# EAGLE design MUDE V2 (EAGLE 7.3.0)

## Sheet 1 of 2
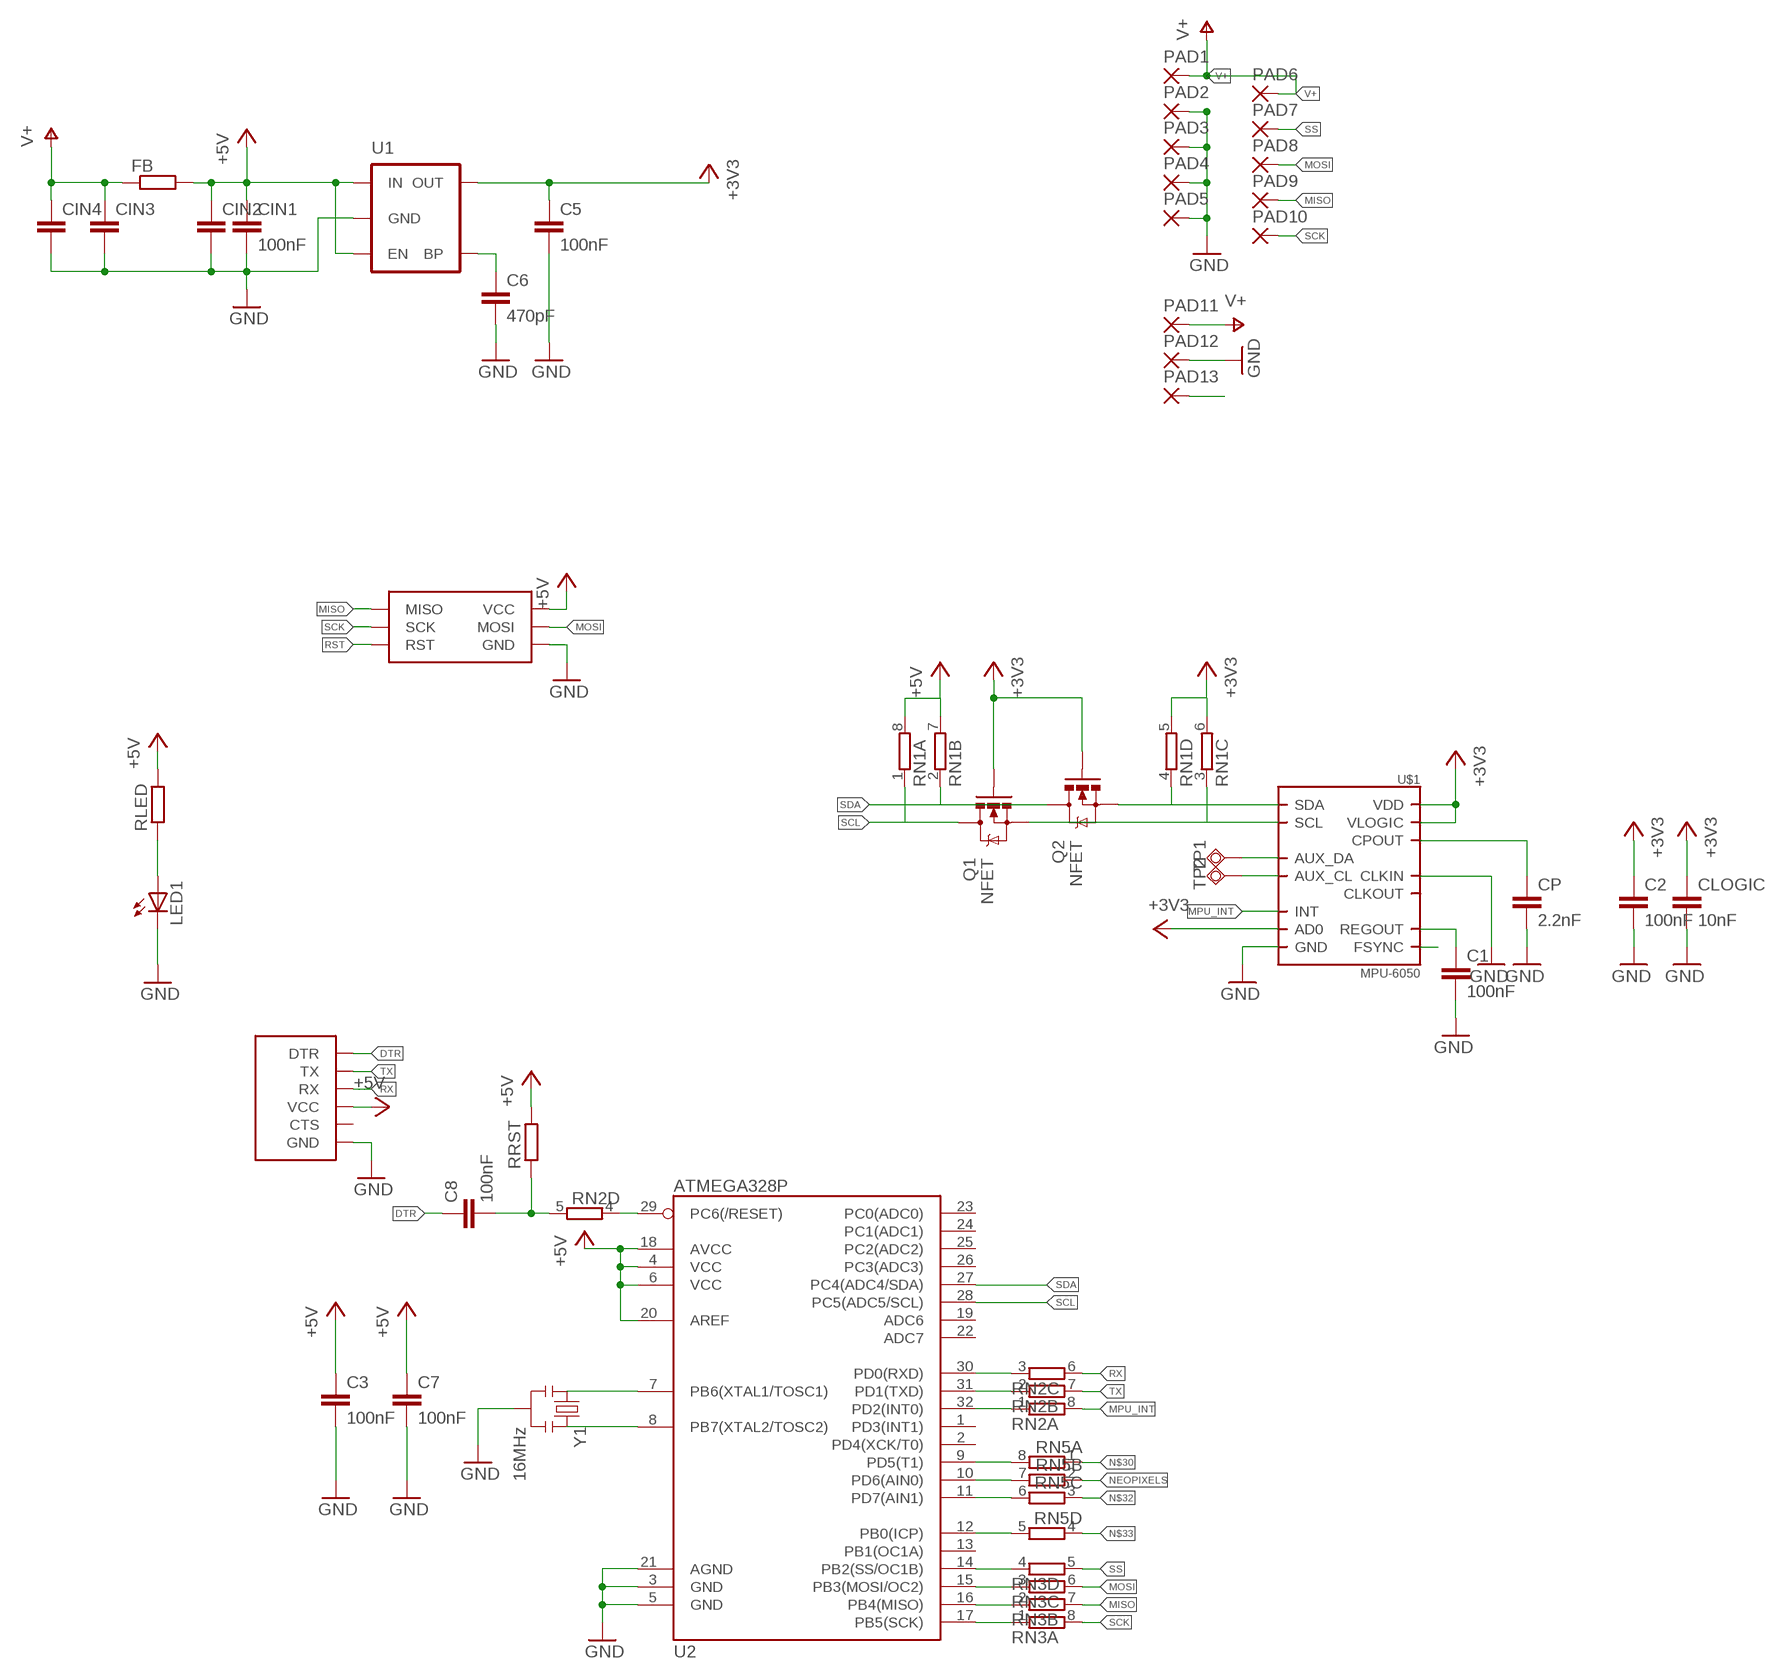
[diagram p0: schematic, sheet 1]

### Parts
C1  100nF  C-EUC0603  [C0603]
C2  100nF  C-EUC0603  [C0603]
C3  100nF  C-EUC0603  [C0603]
C5  100nF  C-EUC0805  [C0805]
C6  470pF  C-EUC0603  [C0603]
C7  100nF  C-EUC0603  [C0603]
C8  100nF  C-EUC0603  [C0603]
CIN1  100nF  C-EUC0603  [C0603]
CIN2  C-EUC0805  [C0805]
CIN3  C-EUC1210  [C1210]
CIN4  C-EUC1210  [C1210]
CLOGIC  10nF  C-EUC0603  [C0603]
CP  2.2nF  C-EUC0603  [C0603]
FB  R-EU_R0603  [R0603]
LED1  LED0603  [LED-0603]
PAD1  SMD2  [SMD1,27-2,54]
PAD2  SMD2  [SMD1,27-2,54]
PAD3  SMD2  [SMD1,27-2,54]
PAD4  SMD2  [SMD1,27-2,54]
PAD5  SMD2  [SMD1,27-2,54]
PAD6  SMD2  [SMD1,27-2,54]
PAD7  SMD2  [SMD1,27-2,54]
PAD8  SMD2  [SMD1,27-2,54]
PAD9  SMD2  [SMD1,27-2,54]
PAD10  SMD2  [SMD1,27-2,54]
PAD11  SMD2  [SMD1,27-2,54]
PAD12  SMD2  [SMD1,27-2,54]
PAD13  SMD2  [SMD1,27-2,54]
Q1  NFET  MOSFET-NCHANNELBSS123LT1G  [SOT23]
Q2  NFET  MOSFET-NCHANNELBSS123LT1G  [SOT23]
RLED  R-EU_R0603  [R0603]
RN1  4R-N0603-ARV  [0603-ARV]
RN2  4R-N0603-ARV  [0603-ARV]
RN3  4R-N0603-ARV  [0603-ARV]
RN5  4R-N0603-ARV  [0603-ARV]
RRST  R-EU_R0603  [R0603]
TP1  TPSQTP10R  [TP10R]
TP2  TPSQTP10R  [TP10R]
U1  MIC52053.3V  [SOT23-5]
U2  ATMEGA328P  ATMEGA328_SMT  [TQFP32-08]
U$1  MPU-6050  [QFN.24.4X4]
U$2  FTDI_HEADERSMD  [FTDI_HEADER_SMD]
U$3  ISP_POGOISP_POGO  [ISP_POGO]
Y1  16MHz  RESONATOR16MHZ  [RESONATOR-SMD]

### Nets
+3V3: C2.1 C5.1 CLOGIC.1 Q1.1(G) Q2.1(G) RN1.5 RN1.6 U1.5(OUT) U$1.8(VLOGIC) U$1.9(AD0) U$1.13(VDD)
+5V: C3.1 C7.1 CIN1.1 CIN2.1 FB.2 RLED.2 RN1.7 RN1.8 RRST.2 U1.1(IN) U1.3(EN) U2.4(VCC) U2.6(VCC) U2.18(AVCC) U2.20(AREF) U$2.VCC U$3.VCC
DTR: C8.1 U$2.DTR
GND: C1.2 C2.2 C3.2 C5.2 C6.2 C7.2 CIN1.2 CIN2.2 CIN3.2 CIN4.2 CLOGIC.2 CP.2 LED1.C PAD2.1(P) PAD3.1(P) PAD4.1(P) PAD5.1(P) PAD12.1(P) U1.2(GND) U2.3(GND) U2.5(GND) U2.21(AGND) U$1.1(CLKIN) U$1.18(GND) U$2.GND U$3.GND Y1.2
MISO: PAD9.1(P) RN3.7 U$3.MISO
MOSI: PAD8.1(P) RN3.6 U$3.MOSI
MPU_INT: RN2.8 U$1.12(INT)
N$1: CP.1 U$1.20(CPOUT)
N$2: RN2.3 U2.30(PD0(RXD))
N$4: TP1.TP U$1.6(AUX_DA)
N$5: C6.1 U1.4(BP)
N$6: TP2.TP U$1.7(AUX_CL)
N$7: Q2.2(S) RN1.4 U$1.24(SDA)
N$8: RN5.8 U2.9(PD5(T1))
N$9: Q1.2(S) RN1.3 U$1.23(SCL)
N$10: U2.7(PB6(XTAL1/TOSC1)) Y1.1
N$11: LED1.A RLED.1
N$12: C1.1 U$1.10(REGOUT)
N$13: U$1.11(FSYNC)
N$14: RN2.2 U2.31(PD1(TXD))
N$15: U2.8(PB7(XTAL2/TOSC2)) Y1.3
N$16: RN5.7 U2.10(PD6(AIN0))
N$18: RN2.1 U2.32(PD2(INT0))
N$19: RN2.4 U2.29(PC6(/RESET))
N$20: RN5.6 U2.11(PD7(AIN1))
N$22: RN3.1 U2.17(PB5(SCK))
N$23: RN3.2 U2.16(PB4(MISO))
N$24: RN3.3 U2.15(PB3(MOSI/OC2))
N$25: RN3.4 U2.14(PB2(SS/OC1B))
N$26: RN5.5 U2.12(PB0(ICP))
N$29: C8.2 RN2.5 RRST.1
N$30: RN5.1
N$32: RN5.3
N$33: RN5.4
NEOPIXELS: PAD13.1(P) RN5.2
RST: U$3.RST
RX: RN2.6 U$2.RX
SCK: PAD10.1(P) RN3.8 U$3.SCK
SCL: Q1.3(D) RN1.1 U2.28(PC5(ADC5/SCL))
SDA: Q2.3(D) RN1.2 U2.27(PC4(ADC4/SDA))
SS: PAD7.1(P) RN3.5
TX: RN2.7 U$2.TX
V+: CIN3.1 CIN4.1 FB.1 PAD1.1(P) PAD6.1(P) PAD11.1(P)
Unconnected: U2.1(PD3(INT1)) U2.2(PD4(XCK/T0)) U2.13(PB1(OC1A)) U2.19(ADC6) U2.22(ADC7) U2.23(PC0(ADC0)) U2.24(PC1(ADC1)) U2.25(PC2(ADC2)) U2.26(PC3(ADC3)) U$1.22(CLKOUT) U$2.CTS

## Sheet 2 of 2

## Library data of the parts
C1-C3 C5-C8 CIN1-CIN4 CLOGIC CP = wes:C-EU: CAPACITOR, European symbol
FB RLED RRST = wes:R-EU_: RESISTOR, European symbol
LED1 = SparkFun-LED:LED: LEDs Standard schematic elements and footprints for 5mm, 3mm, 1206, and 0603 sized LEDs. 5mm - Spark Fun Electronics SKU : COM-00529 (and others)
PAD1-PAD13 = wirepad:SMD2: SMD PAD
Q1 Q2 = SparkFun-DiscreteSemi:MOSFET-NCHANNEL: Common NMOSFET Parts MFG P/N Store ID Prod ID FDD8780 TRANS-09984 SI7820DN TRANS-11055 FDS6630A IC-08089 2N7002PW TRANS-11151 FQP30N06L COM-10213 TRANS-10060 BSS123LT1G TRANS-08345 BSS138 TRANS-00830 BS170 2N7000; PROD_ID: TRANS-08345
RN1-RN3 RN5 = resistor-dil:4R-N: Array Chip Resistor Source: RS Component / Phycomp; OC_FARNELL: unknown; OC_NEWARK: unknown
TP1 TP2 = testpad:TPSQ: Test pad
U1 = SparkFun-PowerIC:MIC5205: MIC5205 150mA vreg 3.3V - VREG-00822 5V - VREG-00823; PROD_ID: VREG-00822
U2 = SparkFun-DigitalIC:ATMEGA328_SMT: 32-Pin Atmega328 part Commonly used on Arduino compatible boards Available in QFP and QFN packages TQFP is IC-09069 QFN is non-stock; PROD_ID: IC-09069
U$1 = invensense:MPU-6050
U$2 = wes:FTDI_HEADER
U$3 = wes:ISP_POGO
Y1 = SparkFun-FreqCtrl:RESONATOR: Resonator Small SMD resonator. Used, eg, on the Arduino Pro/ Pro Mini boards. 8MHz- XTAL-08895 16MHz- XTAL-08900; PROD_ID: XTAL-08900

## Board
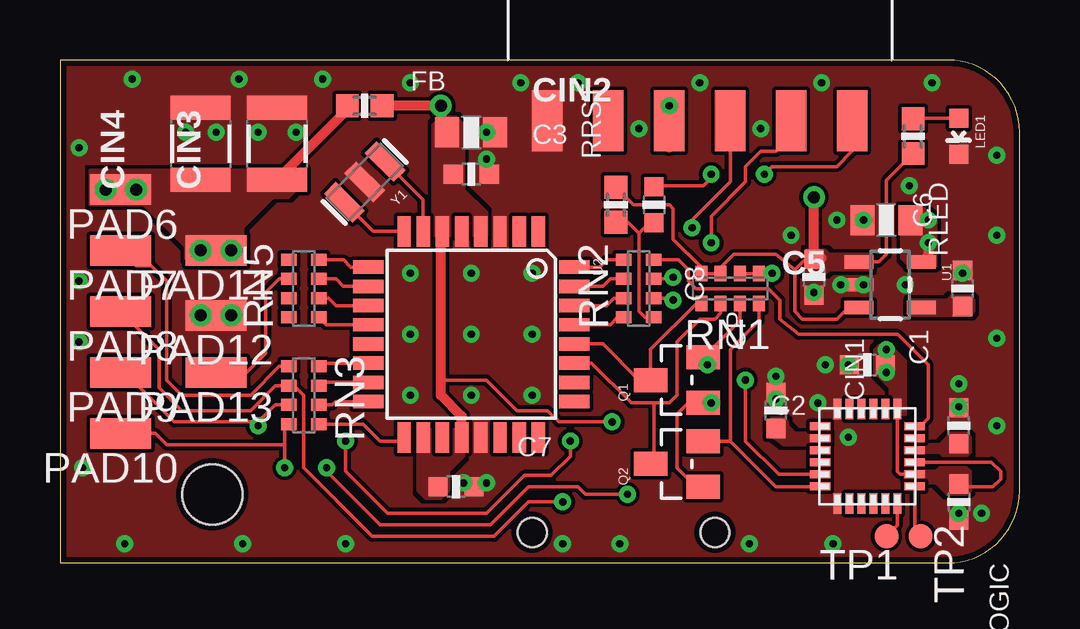
[diagram p1: board, top side]
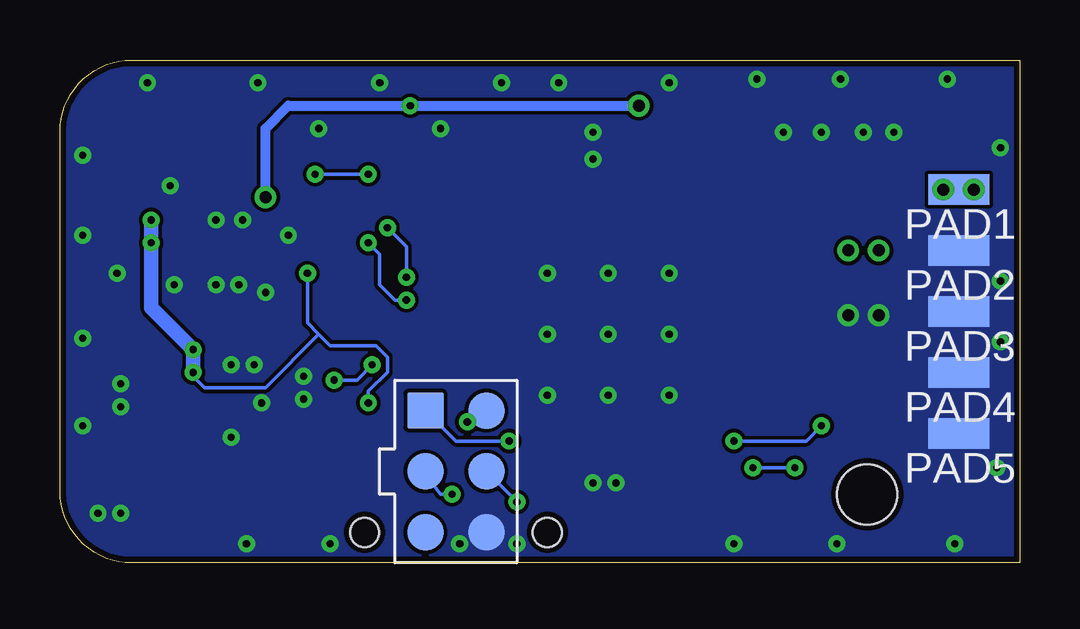
[diagram p2: board, bottom side, seen from below]

Size 40 x 20.95 mm. Coordinates in mm from the lower left corner, seen from the top.
Outline: 0,0 37,0 arc90 40,3 40,17.95 arc90 37,20.95 0,20.95 0,0
Copper layers (1*16): Top 0.035mm / dielectric 1.5mm / Bottom 0.035mm
Design rules "default *": minimum track width 6mil, minimum drill 0.3mm, track to track 6mil, track to pad 6mil, pad to pad 6mil, via to via 6mil, smd to smd 6mil, copper to edge 10mil, drill to drill 8mil, minimum pad ring 10mil, minimum via ring 8mil, stop-mask expansion 4mil, vias tented up to drill 0.3mm, thermal gap 10mil
Holes 2.5 mm at 6.35,2.86

### Footprints (pad centres in the part's own frame; a part is rotated, then mirrored left to right if it is on the bottom)
C0603 = smd 0.8 x 0.8: 1 -0.75,0; 2 0.75,0
C0805 = smd 1 x 1.25: 1 -1,0; 2 1,0
C1210 = smd 1 x 2.5: 1 -1.5,0; 2 1.5,0
R0603 = smd 0.95 x 0.95: 1 -0.725,0; 2 0.725,0
LED-0603 = smd 0.8 x 0.8: A 0,-0.75; C 0,0.75
SMD1,27-2,54 = smd 1.27 x 2.54: 1 0,0
SOT23 = smd 1 x 1.4: 1 -0.95,-1.1; 2 0.95,-1.1; 3 0,1.1
0603-ARV = smd 0.5 x 0.65: 1 -1.2,-0.625; 2 -0.4,-0.625; 3 0.4,-0.625; 4 1.2,-0.625; 5 1.2,0.625; 6 0.4,0.625; 7 -0.4,0.625; 8 -1.2,0.625
TP10R = smd 1 x 1: TP 0,0
SOT23-5 = smd 0.55 x 1.2: 1 -0.95,-1.3; 2 0,-1.3; 3 0.95,-1.3; 4 0.95,1.3; 5 -0.95,1.3
TQFP32-08 = smd 1.27 x 0.559: 1 -4.293,2.8; 2 -4.293,2; 3 -4.293,1.2; 4 -4.293,0.4; 5 -4.293,-0.4; 6 -4.293,-1.2; 7 -4.293,-2; 8 -4.293,-2.8; 17 4.293,-2.8; 18 4.293,-2; 19 4.293,-1.2; 20 4.293,-0.4; 21 4.293,0.4; 22 4.293,1.2; 23 4.293,2; 24 4.293,2.8 | smd 0.559 x 1.27: 9 -2.8,-4.293; 10 -2,-4.293; 11 -1.2,-4.293; 12 -0.4,-4.293; 13 0.4,-4.293; 14 1.2,-4.293; 15 2,-4.293; 16 2.8,-4.293; 25 2.8,4.293; 26 2,4.293; 27 1.2,4.293; 28 0.4,4.293; 29 -0.4,4.293; 30 -1.2,4.293; 31 -2,4.293; 32 -2.8,4.293
QFN.24.4X4 = smd 0.85 x 0.33: 1 -1.975,1.25; 2 -1.975,0.75; 3 -1.975,0.25; 4 -1.975,-0.25; 5 -1.975,-0.75; 6 -1.975,-1.25; 13 1.975,-1.25; 14 1.975,-0.75; 15 1.975,-0.25; 16 1.975,0.25; 17 1.975,0.75; 18 1.975,1.25 | smd 0.33 x 0.85: 7 -1.25,-1.975; 8 -0.75,-1.975; 9 -0.25,-1.975; 10 0.25,-1.975; 11 0.75,-1.975; 12 1.25,-1.975; 19 1.25,1.975; 20 0.75,1.975; 21 0.25,1.975; 22 -0.25,1.975; 23 -0.75,1.975; 24 -1.25,1.975
FTDI_HEADER_SMD = smd 1.27 x 2.54: CTS -3.81,10.16; DTR 6.35,10.16; GND -6.35,10.16; RX 3.81,10.16; TX 1.27,10.16; VCC -1.27,10.16
ISP_POGO = smd 1.524 x 1.524: GND 1.27,-2.54; MISO -1.27,2.54; MOSI 1.27,0; RST -1.27,-2.54; SCK -1.27,0; VCC 1.27,2.54 | hole 1.2: -3.81,-2.54; 3.81,-2.54
RESONATOR-SMD = smd 0.7 x 1.7: 1 -1.2,0; 2 0,0; 3 1.2,0

### Placement (x,y rotation side)
C1  37.47,5.71 90 top
C2  33.66,8.26 180 top
C3  17.14,16.19 0 top
C5  34.45,14.29 180 top
C6  37.62,11.43 90 top
C7  16.51,3.17 0 top
C8  24.77,14.92 270 top
CIN1  31.43,11.91 270 top
CIN2  17.14,17.94 0 top
CIN3  9.05,17.46 90 top
CIN4  5.87,17.46 90 top
CLOGIC  37.47,2.54 270 top
CP  29.84,6.35 90 top
FB  12.7,19.05 0 top
LED1  37.47,17.78 180 top
PAD1  2.54,15.56 90 bottom
PAD2  2.54,13.02 90 bottom
PAD3  2.54,10.48 90 bottom
PAD4  2.54,7.94 90 bottom
PAD5  2.54,5.4 90 bottom
PAD6  2.54,15.56 90 top
PAD7  2.54,13.02 90 top
PAD8  2.54,10.48 90 top
PAD9  2.54,7.94 90 top
PAD10  2.54,5.4 90 top
PAD11  6.51,13.02 90 top
PAD12  6.51,10.32 90 top
PAD13  6.51,7.94 90 top
Q1  25.72,7.62 90 top
Q2  25.72,4.13 90 top
RLED  35.56,17.78 270 top
RN1  27.94,11.43 0 top
RN2  24.13,11.43 270 top
RN3  10.16,6.99 90 top
RN5  10.16,11.43 270 top
RRST  23.18,14.92 90 top
TP1  34.45,1.11 180 top
TP2  35.88,1.11 270 top
U1  34.61,11.59 270 top
U2  17.14,9.53 270 top
U$1  33.66,4.45 90 top
U$2  26.67,8.26 0 top
U$3  23.5,3.81 0 bottom
Y1  12.7,15.88 225 top

### Tracks (layer width: path | path; a pad name or v marks a point on that pad's centre or on a via)
+3V3  (via drill 0.3)
  Top 0.152: U$1.9 38.83,4.2 39.21,3.81 39.21,3.49 38.89,3.17 37.58,3.17 CLOGIC.1 | U$1.13 34.91,3.83 35.04,3.69 U$1.8 | RN1.6 RN1.5 29.21,12.12 v29.69,12.06 | Q2.1 26.51,3.18 25.72,3.97 25.72,6.19 26.2,6.67 Q1.1 v27.14,6.67 v27.15,6.67
  Top 0.406: v36.2,13.34 36.2,12.83 U1.5
  Bottom 0.152: v36.2,14.29 36.2,14.45 | v27.15,6.67 27.15,7.14 26.35,7.94 26.35,8.57 26.83,9.05 28.73,9.05 29.21,9.53 | 29.21,9.53 29.69,10 v29.69,12.06 | v34.45,8.89 34.45,7.78 33.97,7.3 31.43,7.3 29.21,9.53
  Bottom 0.61: v34.45,7.94 v34.45,8.89 36.2,10.64 v36.2,13.34 v36.2,14.29
  pour Top (no thermals): 34.61,6.19 34.61,7.3 33.97,7.94 33.97,8.89 34.13,9.05 34.61,9.05 35.24,8.41 35.24,6.19
  pour Top (no thermals): 35.24,3.81 36.51,3.81 36.67,3.97 37.78,3.97 37.94,3.81 37.94,3.02 37.78,2.86 36.99,2.86 36.51,3.33 35.24,3.33
  pour Top (no thermals): 35.08,14.76 35.08,12.7 35.4,12.38 36.51,12.38 36.51,14.29 36.04,14.76
+5V  (via drill 0.3, 0.5)
  Top 0.152: U$2.VCC 25.4,17.78 | 23.18,16.03 RRST.2 23.9,14.92 25.4,14.92 25.56,14.76 25.56,13.49 26.74,12.31 RN1.8 RN1.7 27.54,12.3 28.1,12.86 29.84,12.86 30.64,12.22 | U1.1 34.13,12.54 34.45,12.86 34.45,15.94 RLED.2 | U1.3 32.86,10.64 32.38,10.16 30.96,10.16 30.64,10.48 30.64,12.22 | CIN1.1 31.07,12.66 30.64,12.22 | v23.02,5.87 20.8,5.87 20.32,6.35 19.05,6.35 17.78,7.62 15.88,7.62
  Top 0.406: U$2.VCC v25.4,19.05 25.4,17.3 | CIN2.1 15.88,18.21 v15.88,19.05 FB.2 | 31.75,12.7 31.43,13.02 v31.43,15.24 | U2.20 16.75,6.12 15.88,6.99 15.88,7.62 15.88,13.75 U2.6
  Bottom 0.152: U$3.VCC 22.54,6.35 v23.02,5.87
  Bottom 0.406: v15.88,19.05 v25.4,19.05 30.48,19.05 31.43,18.1 v31.43,15.24
  pour Top (no thermals): 15.56,13.65 15.56,18.26 15.88,18.57 16.51,18.57 16.83,18.26 16.83,15.56 17.78,14.61 17.78,13.65
  pour Top (no thermals): 14.92,5.56 14.92,3.02 15.24,2.7 15.88,2.7 16.19,3.02 16.19,3.81 16.83,4.45 16.83,5.56
  pour Top (no thermals): 31.11,12.06 31.91,12.06 32.07,12.22 33.81,12.22 33.81,12.86 32.07,12.86 31.91,13.02 31.11,13.02
DTR  (via drill 0.3)
  Top 0.152: v29.37,16.19 29.69,16.51 32.38,16.51 33.02,17.14 U$2.DTR | v27.15,16.19 27.15,16.03 26.83,15.72 24.88,15.72 C8.1
  Bottom 0.152: v29.37,16.19 v27.15,16.19
GND  (via drill 0.3, 0.5)
  other vias: 16.83,3.33 17.78,3.33 32.86,8.26 31.91,8.26 37.47,6.51 37.47,7.46 37.47,2.06 38.42,2.06 29.84,6.83 29.84,7.78 32.54,11.59 33.5,14.29 31.43,11.27 33.5,11.59 37.62,12.06 35.24,11.59 35.4,15.72 7.14,10.32 5.87,10.32 29.21,18.1 26.67,20 24.13,18.1 21.59,20 19.21,20 17.78,17.94 17.78,16.83 32.38,14.29 30.48,13.65 31.75,20 36.35,20 39.05,16.99 39.05,13.65 39.05,9.37 39.05,5.71 32.23,0.79 28.73,0.79 23.34,0.79 20.95,0.79 11.91,0.79 7.62,0.79 2.7,0.79 0.95,3.97 0.79,9.21 0.79,11.75 0.79,17.3 3.02,20.16 7.46,20.16 10.95,20.16 14.61,20 5.24,17.94 6.51,17.94 8.26,17.94 9.84,17.94 17.14,9.53 14.61,12.06 19.68,12.06 19.68,6.99 14.61,6.99 17.14,6.99 17.14,12.06 14.61,9.53 19.68,9.53 32.86,5.24 31.59,6.67
  pour Top (rank 6, no thermals): 0,21.59 40.01,21.59 40.01,0 0,0
  pour Bottom (no thermals): 0,0 0,21.59 40.01,21.59 40.01,0
MISO  (via drill 0.3)
  Top 0.152: v11.91,5.08 11.91,3.81 13.65,2.06 17.78,2.06 19.37,3.65 20.48,3.65 21.27,4.45 v21.27,5.08 | v8.26,5.71 8.26,5.87 | RN3.7 8.97,6.58 8.26,5.87 | PAD9.1 2.7,7.94 4.76,5.87 8.26,5.87
  Bottom 0.152: U$3.MISO 23.5,5.08 v21.27,5.08 | v11.91,5.08 8.89,5.08 v8.26,5.71
MOSI  (via drill 0.3)
  Top 0.152: v20.95,2.54 19.53,2.54 18.1,1.11 13.02,1.11 10.16,3.97 10.16,6.99 9.76,7.38 RN3.6 8.97,7.38 7.94,6.35 5.08,6.35 4.13,7.3 4.13,8.89 PAD8.1
  Bottom 0.152: U$3.MOSI v20.95,2.54
MPU_INT
  Top 0.152: U$1.12 35.86,5.7 36.2,6.03 36.2,8.26 34.92,9.53 30.8,9.53 30,10.16 30,10.95 29.53,11.43 26.51,11.43 26.19,11.75 26.19,12.22 25.79,12.63 RN2.8
N$1
  pour Top (no thermals): 32.07,4.92 30.16,4.92 29.53,5.4 29.53,5.87 29.69,6.03 30.16,6.03 30.32,5.87 30.32,5.71 30.64,5.4 32.07,5.4
N$2
  Top 0.152: U2.30 22.79,10.72 23.09,11.03 RN2.3
N$3  (1 unrouted)
N$4
  Top 0.152: U$1.6 34.91,1.57 TP1.TP
N$5
  pour Top (no thermals): 35.4,10.32 37.94,10.32 38.1,10.48 38.1,10.95 37.94,11.11 37.15,11.11 36.99,10.95 35.4,10.95
N$6
  Top 0.152: U$1.7 35.63,1.36 TP2.TP
N$7
  Top 0.152: U$1.24 31.66,3.17 29.84,3.17 27.94,5.08 | RN1.4 29.14,10.09 27.94,8.89 27.94,5.08 | Q2.2 27.94,5.08
N$8
  Top 0.152: U2.9 12.12,12.32 11.82,12.63 RN5.8
N$9  (via drill 0.3)
  Top 0.152: RN1.3 28.34,10.09 Q1.2 26.99,8.4 v26.99,8.26 | U$1.23 29.96,3.69 28.57,5.08 v28.57,7.62
  Bottom 0.152: v28.57,7.62 27.62,7.62 v26.99,8.26
N$10
  Top 0.152: U2.7 15.14,15.13 Y1.1
N$11
  Top 0.152: LED1.A 35.59,18.53 RLED.1
N$12
  pour Top (no thermals): 35.24,4.6 36.67,4.6 36.83,4.45 37.78,4.45 37.94,4.6 37.94,5.24 37.78,5.4 37.15,5.4 36.67,4.92 35.24,4.92
N$14
  Top 0.152: U2.31 22.64,11.53 22.94,11.83 RN2.2
N$15
  Top 0.152: U2.8 13.06,13.82 Y1.3
N$16
  Top 0.152: U2.10 11.81,11.53 11.51,11.83 RN5.7
N$18
  Top 0.152: U2.32 22.48,12.32 22.79,12.63 RN2.1
N$19
  Top 0.152: U2.29 22.94,9.93 23.25,10.23 RN2.4
N$20
  Top 0.152: U2.11 11.5,10.72 11.2,11.03 RN5.6
N$22
  Top 0.152: RN3.1 12.63,5.79 13.34,5.08 14.19,5.08 U2.17
N$23
  Top 0.152: U2.16 11.49,6.72 11.35,6.58 RN3.2
N$24
  Top 0.152: U2.15 10.93,7.53 RN3.3
N$25
  Top 0.152: U2.14 10.93,8.32 RN3.4
N$26
  Top 0.152: U2.12 11.09,9.93 RN5.5
N$29
  Top 0.152: RN2.5 24.38,10.23 24.13,10.48 24.13,13.74 | 24.13,13.74 23.36,14.52 RRST.1 | 24.13,13.74 24.77,14.38 C8.2
NEOPIXELS
  Top 0.152: RN5.2 9.13,11.83 8.57,11.27 8.57,8.73 7.78,7.94 PAD13.1
RX  (via drill 0.3)
  Top 0.152: RN2.6 25.48,11.03 v25.56,10.95 | v27.15,13.34 27.15,14.45 28.57,15.88 28.57,16.51 29.21,17.14 29.84,17.14 30.48,17.78 U$2.RX
  Bottom 0.152: v25.56,10.95 26.04,10.95 26.67,11.59 26.67,12.86 v27.15,13.34
SCK  (via drill 0.3)
  Top 0.152: v23.65,2.86 21.91,2.86 21.59,3.17 19.53,3.17 17.94,1.59 13.34,1.59 11.11,3.81 v11.11,3.97 | v9.37,3.97 9.37,4.92 | 9.37,4.92 9.37,5.62 RN3.8 | 9.37,4.92 4.45,4.92 3.97,5.4 PAD10.1
  Bottom 0.152: v11.11,3.97 v9.37,3.97 | U$3.SCK 24.77,3.33 24.61,3.49 24.13,2.86 v23.65,2.86
SCL
  Top 0.152: RN1.1 26.52,10.8 24.62,8.9 Q1.3 24.13,7.62 22.62,9.12 U2.28
SDA
  Top 0.152: U2.27 22.16,8.32 23.81,6.67 24.77,6.67 | RN1.2 27.54,10.39 27.3,10.16 26.67,10.16 25.72,9.21 25.72,6.99 25.4,6.67 24.77,6.67 | 24.61,4.14 Q2.3 24.77,4.28 24.77,6.67
SS
  Top 0.152: RN3.5 9.14,8.19 7.94,6.99 5.08,6.99 4.45,7.62 4.45,11.75 3.81,12.38 3.17,12.38 PAD7.1
TX  (via drill 0.3)
  Top 0.152: RN2.7 25.48,11.83 v25.56,11.91 | v26.35,13.97 26.35,14.29 27.94,15.88 U$2.TX
  Bottom 0.152: v25.56,11.91 25.56,13.18 v26.35,13.97
V+  (via drill 0.5)
  Top 0.406: FB.1 11.97,18.89 CIN3.1
  Bottom 0.152: PAD6.1 v3.17,15.56
  other vias: 7.14,13.02 5.87,13.02 1.91,15.56
  pour Top (no thermals): 1.27,14.92 3.49,14.92 5.24,13.18 5.24,12.7 7.62,12.7 7.62,13.97 8.89,15.24 9.53,15.24 10.16,15.88 10.16,16.35 1.27,16.35